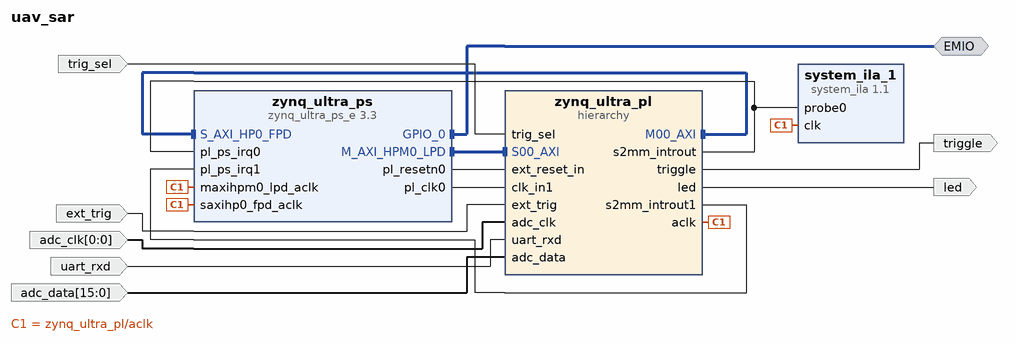
[diagram p0: block diagram of the top level]
# Vivado block design uav_sar, xczu2cg-sfvc784-1-e, Vivado 2020.1
create_bd_design uav_sar

create_bd_intf_port -mode Master -vlnv xilinx.com:interface:gpio_rtl:1.0 EMIO
create_bd_port -dir O triggle
create_bd_port -dir I -from 0 -to 0 -type clk adc_clk
create_bd_port -dir I trig_sel
create_bd_port -dir I ext_trig
create_bd_port -dir I -from 15 -to 0 adc_data
create_bd_port -dir O led
create_bd_port -dir I -type data uart_rxd

create_bd_cell -type ip -vlnv xilinx.com:ip:zynq_ultra_ps_e:3.3 zynq_ultra_ps
set_property -dict [list \
  CONFIG.PSU_BANK_0_IO_STANDARD LVCMOS18 \
  CONFIG.PSU_BANK_1_IO_STANDARD LVCMOS18 \
  CONFIG.PSU_BANK_2_IO_STANDARD LVCMOS18 \
  CONFIG.PSU__CRF_APB__DDR_CTRL__FREQMHZ 1200 \
  CONFIG.PSU__CRF_APB__DDR_CTRL__SRCSEL DPLL \
  CONFIG.PSU__CRF_APB__TOPSW_MAIN_CTRL__SRCSEL APLL \
  CONFIG.PSU__CRL_APB__PL0_REF_CTRL__FREQMHZ 100 \
  CONFIG.PSU__CRL_APB__QSPI_REF_CTRL__FREQMHZ 50 \
  CONFIG.PSU__CRL_APB__SDIO0_REF_CTRL__FREQMHZ 50 \
  CONFIG.PSU__CRL_APB__SDIO0_REF_CTRL__SRCSEL IOPLL \
  CONFIG.PSU__CRL_APB__SDIO1_REF_CTRL__FREQMHZ 50 \
  CONFIG.PSU__CRL_APB__SDIO1_REF_CTRL__SRCSEL IOPLL \
  CONFIG.PSU__DDRC__BUS_WIDTH {64 Bit} \
  CONFIG.PSU__DDRC__COMPONENTS Components \
  CONFIG.PSU__DDRC__DEVICE_CAPACITY {4096 MBits} \
  CONFIG.PSU__DDRC__DRAM_WIDTH {16 Bits} \
  CONFIG.PSU__DDRC__ECC Disabled \
  CONFIG.PSU__DDRC__MEMORY_TYPE {DDR 4} \
  CONFIG.PSU__DDRC__SPEED_BIN DDR4_2400P \
  CONFIG.PSU__DDR_HIGH_ADDRESS_GUI_ENABLE 0 \
  CONFIG.PSU__DDR__INTERFACE__FREQMHZ 600.000 \
  CONFIG.PSU__DLL__ISUSED 1 \
  CONFIG.PSU__ENET3__FIFO__ENABLE 0 \
  CONFIG.PSU__ENET3__GRP_MDIO__ENABLE 1 \
  CONFIG.PSU__ENET3__GRP_MDIO__IO {MIO 76 .. 77} \
  CONFIG.PSU__ENET3__PERIPHERAL__ENABLE 1 \
  CONFIG.PSU__ENET3__PERIPHERAL__IO {MIO 64 .. 75} \
  CONFIG.PSU__ENET3__PTP__ENABLE 0 \
  CONFIG.PSU__ENET3__TSU__ENABLE 0 \
  CONFIG.PSU__GEM3_COHERENCY 0 \
  CONFIG.PSU__GEM3_ROUTE_THROUGH_FPD 0 \
  CONFIG.PSU__GEM__TSU__ENABLE 0 \
  CONFIG.PSU__GPIO0_MIO__PERIPHERAL__ENABLE 0 \
  CONFIG.PSU__GPIO1_MIO__IO {MIO 26 .. 51} \
  CONFIG.PSU__GPIO1_MIO__PERIPHERAL__ENABLE 1 \
  CONFIG.PSU__GPIO_EMIO_WIDTH 26 \
  CONFIG.PSU__GPIO_EMIO__PERIPHERAL__ENABLE 1 \
  CONFIG.PSU__GPIO_EMIO__PERIPHERAL__IO 26 \
  CONFIG.PSU__PCIE__BAR0_ENABLE 1 \
  CONFIG.PSU__PCIE__BAR0_SCALE Gigabytes \
  CONFIG.PSU__PCIE__BAR0_SIZE 256 \
  CONFIG.PSU__PCIE__BAR0_TYPE Memory \
  CONFIG.PSU__PCIE__BAR0_VAL 0xffffffc0 \
  CONFIG.PSU__PCIE__BAR1_VAL 0x0 \
  CONFIG.PSU__PCIE__BAR2_VAL 0x0 \
  CONFIG.PSU__PCIE__BAR3_VAL 0x0 \
  CONFIG.PSU__PCIE__BAR4_VAL 0x0 \
  CONFIG.PSU__PCIE__BAR5_VAL 0x0 \
  CONFIG.PSU__PCIE__CLASS_CODE_BASE 0x06 \
  CONFIG.PSU__PCIE__CLASS_CODE_INTERFACE 0x0 \
  CONFIG.PSU__PCIE__CLASS_CODE_SUB 0x04 \
  CONFIG.PSU__PCIE__CLASS_CODE_VALUE 0x60400 \
  CONFIG.PSU__PCIE__DEVICE_ID 0xD011 \
  CONFIG.PSU__PCIE__DEVICE_PORT_TYPE {Root Port} \
  CONFIG.PSU__PCIE__EROM_VAL 0x0 \
  CONFIG.PSU__PCIE__INTX_GENERATION 1 \
  CONFIG.PSU__PCIE__LANE0__ENABLE 1 \
  CONFIG.PSU__PCIE__LANE0__IO {GT Lane0} \
  CONFIG.PSU__PCIE__LINK_SPEED {5.0 Gb/s} \
  CONFIG.PSU__PCIE__MAXIMUM_LINK_WIDTH x1 \
  CONFIG.PSU__PCIE__MAX_PAYLOAD_SIZE {256 bytes} \
  CONFIG.PSU__PCIE__PERIPHERAL__ENABLE 1 \
  CONFIG.PSU__PCIE__PERIPHERAL__ENDPOINT_ENABLE 0 \
  CONFIG.PSU__PCIE__PERIPHERAL__ROOTPORT_ENABLE 1 \
  CONFIG.PSU__PCIE__PERIPHERAL__ROOTPORT_IO {MIO 37} \
  CONFIG.PSU__PCIE__REF_CLK_FREQ 100 \
  CONFIG.PSU__PCIE__REF_CLK_SEL {Ref Clk0} \
  CONFIG.PSU__PCIE__REVISION_ID 0x0 \
  CONFIG.PSU__PCIE__SUBSYSTEM_ID 0x7 \
  CONFIG.PSU__PCIE__SUBSYSTEM_VENDOR_ID 0x10EE \
  CONFIG.PSU__PCIE__VENDOR_ID 0x10EE \
  CONFIG.PSU__PSS_REF_CLK__FREQMHZ 33.333 \
  CONFIG.PSU__QSPI_COHERENCY 0 \
  CONFIG.PSU__QSPI_ROUTE_THROUGH_FPD 0 \
  CONFIG.PSU__QSPI__GRP_FBCLK__ENABLE 1 \
  CONFIG.PSU__QSPI__GRP_FBCLK__IO {MIO 6} \
  CONFIG.PSU__QSPI__PERIPHERAL__DATA_MODE x4 \
  CONFIG.PSU__QSPI__PERIPHERAL__ENABLE 1 \
  CONFIG.PSU__QSPI__PERIPHERAL__IO {MIO 0 .. 5} \
  CONFIG.PSU__QSPI__PERIPHERAL__MODE Single \
  CONFIG.PSU__SD0__DATA_TRANSFER_MODE 8Bit \
  CONFIG.PSU__SD0__GRP_POW__ENABLE 1 \
  CONFIG.PSU__SD0__GRP_POW__IO {MIO 23} \
  CONFIG.PSU__SD0__PERIPHERAL__ENABLE 1 \
  CONFIG.PSU__SD0__PERIPHERAL__IO {MIO 13 .. 22} \
  CONFIG.PSU__SD0__RESET__ENABLE 1 \
  CONFIG.PSU__SD0__SLOT_TYPE eMMC \
  CONFIG.PSU__SD1_COHERENCY 0 \
  CONFIG.PSU__SD1_ROUTE_THROUGH_FPD 0 \
  CONFIG.PSU__SD1__DATA_TRANSFER_MODE 4Bit \
  CONFIG.PSU__SD1__GRP_CD__ENABLE 1 \
  CONFIG.PSU__SD1__GRP_CD__IO {MIO 45} \
  CONFIG.PSU__SD1__GRP_POW__ENABLE 0 \
  CONFIG.PSU__SD1__GRP_WP__ENABLE 0 \
  CONFIG.PSU__SD1__PERIPHERAL__ENABLE 1 \
  CONFIG.PSU__SD1__PERIPHERAL__IO {MIO 46 .. 51} \
  CONFIG.PSU__SD1__SLOT_TYPE {SD 2.0} \
  CONFIG.PSU__TSU__BUFG_PORT_PAIR 0 \
  CONFIG.PSU__TTC0__CLOCK__ENABLE 0 \
  CONFIG.PSU__TTC0__PERIPHERAL__ENABLE 1 \
  CONFIG.PSU__TTC0__WAVEOUT__ENABLE 0 \
  CONFIG.PSU__TTC1__CLOCK__ENABLE 0 \
  CONFIG.PSU__TTC1__PERIPHERAL__ENABLE 1 \
  CONFIG.PSU__TTC1__WAVEOUT__ENABLE 0 \
  CONFIG.PSU__TTC2__CLOCK__ENABLE 0 \
  CONFIG.PSU__TTC2__PERIPHERAL__ENABLE 1 \
  CONFIG.PSU__TTC2__WAVEOUT__ENABLE 0 \
  CONFIG.PSU__TTC3__CLOCK__ENABLE 0 \
  CONFIG.PSU__TTC3__PERIPHERAL__ENABLE 1 \
  CONFIG.PSU__TTC3__WAVEOUT__ENABLE 0 \
  CONFIG.PSU__UART0__BAUD_RATE 115200 \
  CONFIG.PSU__UART0__MODEM__ENABLE 0 \
  CONFIG.PSU__UART0__PERIPHERAL__ENABLE 1 \
  CONFIG.PSU__UART0__PERIPHERAL__IO {MIO 42 .. 43} \
  CONFIG.PSU__UART1__BAUD_RATE 115200 \
  CONFIG.PSU__UART1__MODEM__ENABLE 0 \
  CONFIG.PSU__UART1__PERIPHERAL__ENABLE 1 \
  CONFIG.PSU__UART1__PERIPHERAL__IO {MIO 24 .. 25} \
  CONFIG.PSU__USE__IRQ0 1 \
  CONFIG.PSU__USE__IRQ1 1 \
  CONFIG.PSU__USE__M_AXI_GP0 0 \
  CONFIG.PSU__USE__S_AXI_GP2 1 \
  CONFIG.SUBPRESET1 Custom \
] [get_bd_cells zynq_ultra_ps]
# 118 more settings of zynq_ultra_ps are not shown: defaults, MIO pin electricals, DDR timing, and values the tool derives
create_bd_cell -type hier zynq_ultra_pl
create_bd_cell -type ip -vlnv xilinx.com:ip:system_ila:1.1 system_ila_1
set_property -dict {CONFIG.C_MON_TYPE NATIVE CONFIG.C_NUM_OF_PROBES 1 CONFIG.C_PROBE0_TYPE 0} [get_bd_cells system_ila_1]

# ---- hierarchy /zynq_ultra_pl ----
current_bd_instance /zynq_ultra_pl
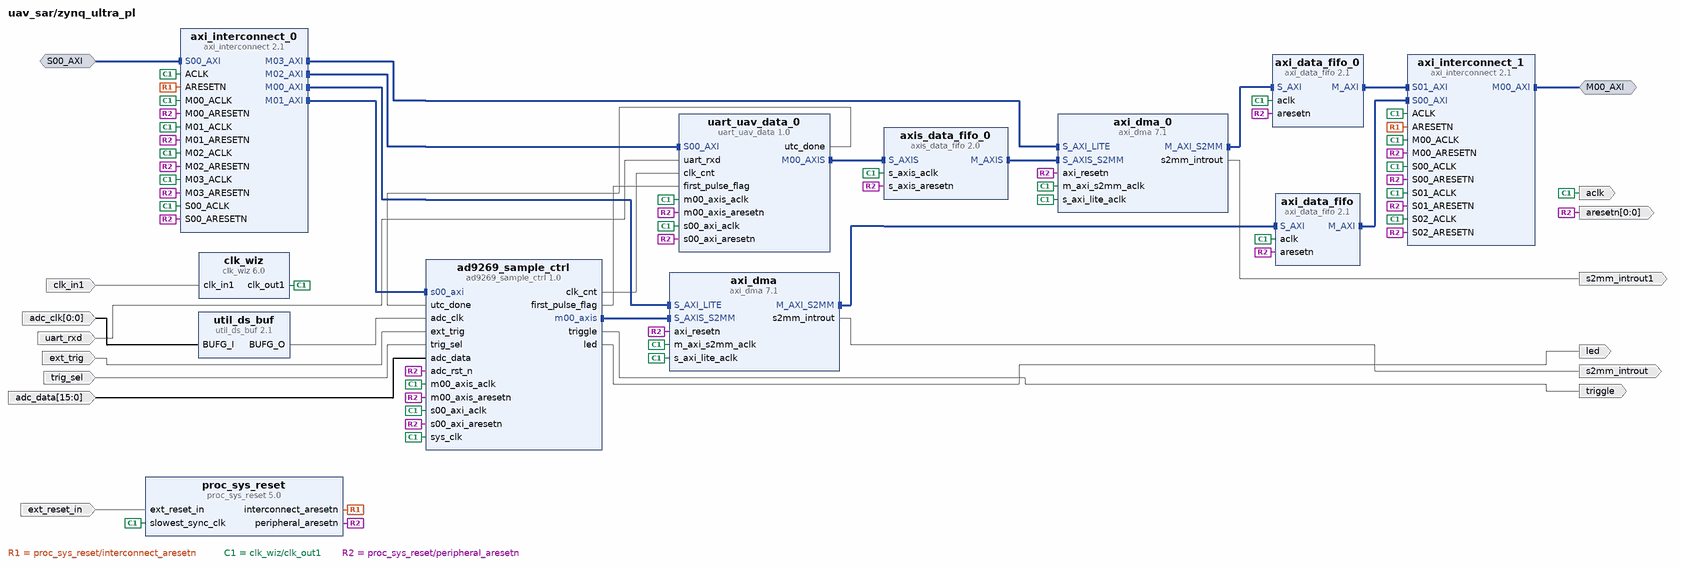
[diagram p1: block diagram inside /zynq_ultra_pl]
create_bd_intf_pin -mode Slave -vlnv xilinx.com:interface:aximm_rtl:1.0 S00_AXI
create_bd_intf_pin -mode Master -vlnv xilinx.com:interface:aximm_rtl:1.0 M00_AXI
create_bd_pin -dir I -type clk clk_in1
create_bd_pin -dir O -type clk aclk
create_bd_pin -dir I -from 0 -to 0 -type clk adc_clk
create_bd_pin -dir I -type rst ext_reset_in
create_bd_pin -dir O -from 0 -to 0 -type rst aresetn
create_bd_pin -dir I ext_trig
create_bd_pin -dir I trig_sel
create_bd_pin -dir O triggle
create_bd_pin -dir O led
create_bd_pin -dir I -type data uart_rxd
create_bd_pin -dir O -type intr s2mm_introut
create_bd_pin -dir O -type intr s2mm_introut1
create_bd_pin -dir I -from 15 -to 0 adc_data

create_bd_cell -type ip -vlnv xilinx.com:ip:clk_wiz:6.0 clk_wiz
set_property -dict [list \
  CONFIG.AUTO_PRIMITIVE PLL \
  CONFIG.CLKIN1_JITTER_PS 100.0 \
  CONFIG.CLKIN2_JITTER_PS 100.0 \
  CONFIG.CLKOUT1_DRIVES Buffer \
  CONFIG.CLKOUT1_JITTER 167.018 \
  CONFIG.CLKOUT1_PHASE_ERROR 114.213 \
  CONFIG.CLKOUT1_REQUESTED_OUT_FREQ 50 \
  CONFIG.CLKOUT2_DRIVES Buffer \
  CONFIG.CLKOUT3_DRIVES Buffer \
  CONFIG.CLKOUT4_DRIVES Buffer \
  CONFIG.CLKOUT5_DRIVES Buffer \
  CONFIG.CLKOUT6_DRIVES Buffer \
  CONFIG.CLKOUT7_DRIVES Buffer \
  CONFIG.FEEDBACK_SOURCE FDBK_AUTO \
  CONFIG.MMCM_BANDWIDTH OPTIMIZED \
  CONFIG.MMCM_CLKFBOUT_MULT_F 8 \
  CONFIG.MMCM_CLKIN1_PERIOD 10.000 \
  CONFIG.MMCM_CLKIN2_PERIOD 10.000 \
  CONFIG.MMCM_CLKOUT0_DIVIDE_F 16 \
  CONFIG.MMCM_COMPENSATION AUTO \
  CONFIG.MMCM_DIVCLK_DIVIDE 1 \
  CONFIG.PRIMITIVE Auto \
  CONFIG.SECONDARY_IN_FREQ 100.000 \
  CONFIG.SECONDARY_SOURCE Single_ended_clock_capable_pin \
  CONFIG.USE_INCLK_SWITCHOVER false \
  CONFIG.USE_LOCKED false \
  CONFIG.USE_RESET false \
] [get_bd_cells clk_wiz]
create_bd_cell -type ip -vlnv xilinx.com:ip:util_ds_buf:2.1 util_ds_buf
set_property -dict {CONFIG.C_BUF_TYPE BUFG} [get_bd_cells util_ds_buf]
create_bd_cell -type ip -vlnv xilinx.com:ip:proc_sys_reset:5.0 proc_sys_reset
create_bd_cell -type ip -vlnv xilinx.com:ip:axis_data_fifo:2.0 axis_data_fifo_0
set_property -dict {CONFIG.HAS_AEMPTY 0 CONFIG.HAS_PROG_EMPTY 0 CONFIG.HAS_RD_DATA_COUNT 0} [get_bd_cells axis_data_fifo_0]
create_bd_cell -type ip -vlnv xilinx.com:ip:axi_dma:7.1 axi_dma
set_property -dict [list \
  CONFIG.c_addr_width 64 \
  CONFIG.c_include_mm2s 0 \
  CONFIG.c_include_sg 0 \
  CONFIG.c_sg_length_width 26 \
] [get_bd_cells axi_dma]
create_bd_cell -type ip -vlnv xilinx.com:ip:axi_dma:7.1 axi_dma_0
set_property -dict [list \
  CONFIG.c_addr_width 64 \
  CONFIG.c_include_mm2s 0 \
  CONFIG.c_include_sg 0 \
  CONFIG.c_sg_length_width 26 \
] [get_bd_cells axi_dma_0]
create_bd_cell -type ip -vlnv xilinx.com:ip:axi_data_fifo:2.1 axi_data_fifo
create_bd_cell -type ip -vlnv xilinx.com:ip:axi_data_fifo:2.1 axi_data_fifo_0
set_property -dict [list \
  CONFIG.ADDR_WIDTH 64 \
  CONFIG.DATA_WIDTH 32 \
  CONFIG.ID_WIDTH 0 \
  CONFIG.PROTOCOL AXI4 \
  CONFIG.READ_WRITE_MODE WRITE_ONLY \
] [get_bd_cells axi_data_fifo_0]
create_bd_cell -type ip -vlnv xilinx.com:ip:axi_interconnect:2.1 axi_interconnect_0
set_property -dict {CONFIG.NUM_MI 4} [get_bd_cells axi_interconnect_0]
create_bd_cell -type ip -vlnv xilinx.com:ip:axi_interconnect:2.1 axi_interconnect_1
set_property -dict {CONFIG.NUM_MI 1 CONFIG.NUM_SI 3} [get_bd_cells axi_interconnect_1]
create_bd_cell -type ip -vlnv xilinx.com:user:ad9269_sample_ctrl:1.0 ad9269_sample_ctrl
set_property -dict {CONFIG.C_S00_AXI_ADDR_WIDTH 6 CONFIG.C_S00_AXI_DATA_WIDTH 64} [get_bd_cells ad9269_sample_ctrl]
create_bd_cell -type ip -vlnv xilinx.com:user:uart_uav_data:1.0 uart_uav_data_0

# ---- connections ----

current_bd_instance /zynq_ultra_pl
connect_bd_intf_net [get_bd_intf_pins ad9269_sample_ctrl/s00_axi] [get_bd_intf_pins axi_interconnect_0/M01_AXI]
connect_bd_intf_net [get_bd_intf_pins axi_interconnect_1/S00_AXI] [get_bd_intf_pins axi_data_fifo/M_AXI]
connect_bd_intf_net [get_bd_intf_pins axi_dma_0/S_AXI_LITE] [get_bd_intf_pins axi_interconnect_0/M03_AXI]
connect_bd_intf_net [get_bd_intf_pins axi_dma/M_AXI_S2MM] [get_bd_intf_pins axi_data_fifo/S_AXI]
connect_bd_intf_net -intf_net axis_data_fifo_M_AXIS [get_bd_intf_pins axi_dma/S_AXIS_S2MM] [get_bd_intf_pins ad9269_sample_ctrl/m00_axis]
connect_bd_intf_net [get_bd_intf_pins axis_data_fifo_0/S_AXIS] [get_bd_intf_pins uart_uav_data_0/M00_AXIS]
connect_bd_intf_net -intf_net sample_ctrl_M00_AXI [get_bd_intf_pins M00_AXI] [get_bd_intf_pins axi_interconnect_1/M00_AXI]
connect_bd_intf_net [get_bd_intf_pins axi_interconnect_1/S01_AXI] [get_bd_intf_pins axi_data_fifo_0/M_AXI]
connect_bd_intf_net [get_bd_intf_pins axis_data_fifo_0/M_AXIS] [get_bd_intf_pins axi_dma_0/S_AXIS_S2MM]
connect_bd_intf_net [get_bd_intf_pins axi_dma_0/M_AXI_S2MM] [get_bd_intf_pins axi_data_fifo_0/S_AXI]
connect_bd_intf_net [get_bd_intf_pins axi_interconnect_0/M02_AXI] [get_bd_intf_pins uart_uav_data_0/S00_AXI]
connect_bd_intf_net -intf_net zynq_ultra_ps_M_AXI_HPM0_LPD [get_bd_intf_pins S00_AXI] [get_bd_intf_pins axi_interconnect_0/S00_AXI]
connect_bd_intf_net [get_bd_intf_pins axi_dma/S_AXI_LITE] [get_bd_intf_pins axi_interconnect_0/M00_AXI]
connect_bd_net -net adc_clk [get_bd_pins util_ds_buf/BUFG_O] [get_bd_pins ad9269_sample_ctrl/adc_clk]
connect_bd_net -net ARESETN_1 [get_bd_pins proc_sys_reset/interconnect_aresetn] \
  [get_bd_pins axi_interconnect_1/ARESETN] [get_bd_pins axi_interconnect_0/ARESETN]
connect_bd_net [get_bd_pins uart_uav_data_0/utc_done] [get_bd_pins ad9269_sample_ctrl/utc_done]
connect_bd_net [get_bd_pins ad9269_sample_ctrl/clk_cnt] [get_bd_pins uart_uav_data_0/clk_cnt]
connect_bd_net -net clk_in1_1 [get_bd_pins clk_in1] [get_bd_pins clk_wiz/clk_in1]
connect_bd_net -net zynq_ultra_pl_clk_out1 [get_bd_pins clk_wiz/clk_out1] \
  [get_bd_pins aclk] [get_bd_pins axi_data_fifo_0/aclk] [get_bd_pins axi_interconnect_0/ACLK] \
  [get_bd_pins axi_interconnect_0/S00_ACLK] [get_bd_pins axi_interconnect_0/M00_ACLK] \
  [get_bd_pins axi_interconnect_0/M01_ACLK] [get_bd_pins axi_interconnect_0/M02_ACLK] \
  [get_bd_pins axi_interconnect_0/M03_ACLK] [get_bd_pins axi_interconnect_1/S01_ACLK] [get_bd_pins axi_dma_0/m_axi_s2mm_aclk] \
  [get_bd_pins axi_dma_0/s_axi_lite_aclk] [get_bd_pins axis_data_fifo_0/s_axis_aclk] \
  [get_bd_pins proc_sys_reset/slowest_sync_clk] [get_bd_pins axi_data_fifo/aclk] [get_bd_pins axi_interconnect_1/M00_ACLK] \
  [get_bd_pins axi_interconnect_1/S00_ACLK] [get_bd_pins axi_interconnect_1/ACLK] [get_bd_pins axi_dma/m_axi_s2mm_aclk] \
  [get_bd_pins axi_dma/s_axi_lite_aclk] [get_bd_pins axi_interconnect_1/S02_ACLK] [get_bd_pins ad9269_sample_ctrl/sys_clk] \
  [get_bd_pins ad9269_sample_ctrl/m00_axis_aclk] [get_bd_pins ad9269_sample_ctrl/s00_axi_aclk] \
  [get_bd_pins uart_uav_data_0/s00_axi_aclk] [get_bd_pins uart_uav_data_0/m00_axis_aclk]
connect_bd_net [get_bd_pins adc_clk] [get_bd_pins util_ds_buf/BUFG_I]
connect_bd_net -net zynq_ultra_ps_pl_resetn0 [get_bd_pins ext_reset_in] [get_bd_pins proc_sys_reset/ext_reset_in]
connect_bd_net -net zynq_ultra_pl_peripheral_aresetn [get_bd_pins proc_sys_reset/peripheral_aresetn] \
  [get_bd_pins aresetn] [get_bd_pins axi_data_fifo_0/aresetn] [get_bd_pins axi_interconnect_0/S00_ARESETN] \
  [get_bd_pins axi_interconnect_0/M00_ARESETN] [get_bd_pins axi_interconnect_0/M01_ARESETN] \
  [get_bd_pins axi_interconnect_0/M02_ARESETN] [get_bd_pins axi_interconnect_0/M03_ARESETN] \
  [get_bd_pins axi_interconnect_1/S01_ARESETN] [get_bd_pins axi_dma_0/axi_resetn] \
  [get_bd_pins axis_data_fifo_0/s_axis_aresetn] [get_bd_pins axi_data_fifo/aresetn] \
  [get_bd_pins axi_interconnect_1/S00_ARESETN] [get_bd_pins axi_interconnect_1/M00_ARESETN] [get_bd_pins axi_dma/axi_resetn] \
  [get_bd_pins axi_interconnect_1/S02_ARESETN] [get_bd_pins ad9269_sample_ctrl/adc_rst_n] \
  [get_bd_pins ad9269_sample_ctrl/m00_axis_aresetn] [get_bd_pins ad9269_sample_ctrl/s00_axi_aresetn] \
  [get_bd_pins uart_uav_data_0/s00_axi_aresetn] [get_bd_pins uart_uav_data_0/m00_axis_aresetn]
connect_bd_net [get_bd_pins ext_trig] [get_bd_pins ad9269_sample_ctrl/ext_trig]
connect_bd_net [get_bd_pins trig_sel] [get_bd_pins ad9269_sample_ctrl/trig_sel]
connect_bd_net [get_bd_pins ad9269_sample_ctrl/triggle] [get_bd_pins triggle]
connect_bd_net -net zynq_ultra_pl_led [get_bd_pins ad9269_sample_ctrl/led] [get_bd_pins led]
connect_bd_net [get_bd_pins uart_rxd] [get_bd_pins uart_uav_data_0/uart_rxd]
connect_bd_net -net axi_dma_0_s2mm_introut [get_bd_pins axi_dma/s2mm_introut] [get_bd_pins s2mm_introut]
connect_bd_net -net zynq_ultra_pl_s2mm_introut1 [get_bd_pins axi_dma_0/s2mm_introut] [get_bd_pins s2mm_introut1]
connect_bd_net [get_bd_pins ad9269_sample_ctrl/first_pulse_flag] [get_bd_pins uart_uav_data_0/first_pulse_flag]
connect_bd_net [get_bd_pins adc_data] [get_bd_pins ad9269_sample_ctrl/adc_data]
set_property HDL_ATTRIBUTE.DEBUG true [get_bd_nets axi_dma_0_s2mm_introut]
set_property HDL_ATTRIBUTE.MARK_DEBUG true [get_bd_nets axi_dma_0_s2mm_introut]

current_bd_instance /
connect_bd_intf_net -intf_net sample_ctrl_M00_AXI [get_bd_intf_pins zynq_ultra_ps/S_AXI_HP0_FPD] [get_bd_intf_pins zynq_ultra_pl/M00_AXI]
connect_bd_intf_net [get_bd_intf_pins zynq_ultra_ps/M_AXI_HPM0_LPD] [get_bd_intf_pins zynq_ultra_pl/S00_AXI]
connect_bd_intf_net -intf_net zynq_ultra_ps_e_0_GPIO_0 [get_bd_intf_ports EMIO] [get_bd_intf_pins zynq_ultra_ps/GPIO_0]
connect_bd_net -net ad9269_sample_ctrl_triggle [get_bd_pins zynq_ultra_pl/triggle] [get_bd_ports triggle]
connect_bd_net [get_bd_ports trig_sel] [get_bd_pins zynq_ultra_pl/trig_sel]
connect_bd_net [get_bd_ports ext_trig] [get_bd_pins zynq_ultra_pl/ext_trig]
connect_bd_net -net axi_dma_0_s2mm_introut [get_bd_pins zynq_ultra_pl/s2mm_introut] \
  [get_bd_pins zynq_ultra_ps/pl_ps_irq0] [get_bd_pins system_ila_1/probe0]
connect_bd_net [get_bd_ports adc_clk] [get_bd_pins zynq_ultra_pl/adc_clk]
connect_bd_net [get_bd_pins zynq_ultra_pl/led] [get_bd_ports led]
connect_bd_net [get_bd_pins zynq_ultra_ps/pl_resetn0] [get_bd_pins zynq_ultra_pl/ext_reset_in]
connect_bd_net [get_bd_ports uart_rxd] [get_bd_pins zynq_ultra_pl/uart_rxd]
connect_bd_net [get_bd_pins zynq_ultra_pl/s2mm_introut1] [get_bd_pins zynq_ultra_ps/pl_ps_irq1]
connect_bd_net [get_bd_pins zynq_ultra_pl/aclk] \
  [get_bd_pins zynq_ultra_ps/maxihpm0_lpd_aclk] [get_bd_pins zynq_ultra_ps/saxihp0_fpd_aclk] [get_bd_pins system_ila_1/clk]
connect_bd_net [get_bd_pins zynq_ultra_ps/pl_clk0] [get_bd_pins zynq_ultra_pl/clk_in1]
connect_bd_net [get_bd_ports adc_data] [get_bd_pins zynq_ultra_pl/adc_data]
set_property HDL_ATTRIBUTE.DEBUG true [get_bd_nets axi_dma_0_s2mm_introut]

# ---- address map ----
assign_bd_address -offset 0x0000000000000000 -range 2G -target_address_space [get_bd_addr_spaces zynq_ultra_pl/axi_dma/Data_S2MM] [get_bd_addr_segs zynq_ultra_ps/SAXIGP2/HP0_DDR_LOW]
assign_bd_address -offset 0x00000000C0000000 -range 512M -target_address_space [get_bd_addr_spaces zynq_ultra_pl/axi_dma/Data_S2MM] [get_bd_addr_segs zynq_ultra_ps/SAXIGP2/HP0_QSPI]
assign_bd_address -offset 0x00000000E0000000 -range 256M -target_address_space [get_bd_addr_spaces zynq_ultra_pl/axi_dma/Data_S2MM] [get_bd_addr_segs zynq_ultra_ps/SAXIGP2/HP0_PCIE_LOW]
exclude_bd_addr_seg -offset 0x00000000FF000000 -range 16M -target_address_space [get_bd_addr_spaces zynq_ultra_pl/axi_dma/Data_S2MM] [get_bd_addr_segs zynq_ultra_ps/SAXIGP2/HP0_LPS_OCM]
assign_bd_address -offset 0x0000000000000000 -range 2G -target_address_space [get_bd_addr_spaces zynq_ultra_pl/axi_dma_0/Data_S2MM] [get_bd_addr_segs zynq_ultra_ps/SAXIGP2/HP0_DDR_LOW]
assign_bd_address -offset 0x00000000C0000000 -range 512M -target_address_space [get_bd_addr_spaces zynq_ultra_pl/axi_dma_0/Data_S2MM] [get_bd_addr_segs zynq_ultra_ps/SAXIGP2/HP0_QSPI]
assign_bd_address -offset 0x00000000E0000000 -range 256M -target_address_space [get_bd_addr_spaces zynq_ultra_pl/axi_dma_0/Data_S2MM] [get_bd_addr_segs zynq_ultra_ps/SAXIGP2/HP0_PCIE_LOW]
exclude_bd_addr_seg -offset 0x00000000FF000000 -range 16M -target_address_space [get_bd_addr_spaces zynq_ultra_pl/axi_dma_0/Data_S2MM] [get_bd_addr_segs zynq_ultra_ps/SAXIGP2/HP0_LPS_OCM]
assign_bd_address -offset 0x0080000000 -range 64K -target_address_space [get_bd_addr_spaces zynq_ultra_ps/Data] [get_bd_addr_segs zynq_ultra_pl/ad9269_sample_ctrl/s00_axi/reg0]
assign_bd_address -offset 0x0080010000 -range 64K -target_address_space [get_bd_addr_spaces zynq_ultra_ps/Data] [get_bd_addr_segs zynq_ultra_pl/axi_dma/S_AXI_LITE/Reg]
assign_bd_address -offset 0x0080020000 -range 64K -target_address_space [get_bd_addr_spaces zynq_ultra_ps/Data] [get_bd_addr_segs zynq_ultra_pl/axi_dma_0/S_AXI_LITE/Reg]
assign_bd_address -offset 0x0080030000 -range 64K -target_address_space [get_bd_addr_spaces zynq_ultra_ps/Data] [get_bd_addr_segs zynq_ultra_pl/uart_uav_data_0/S00_AXI/S00_AXI_reg]

validate_bd_design
save_bd_design
